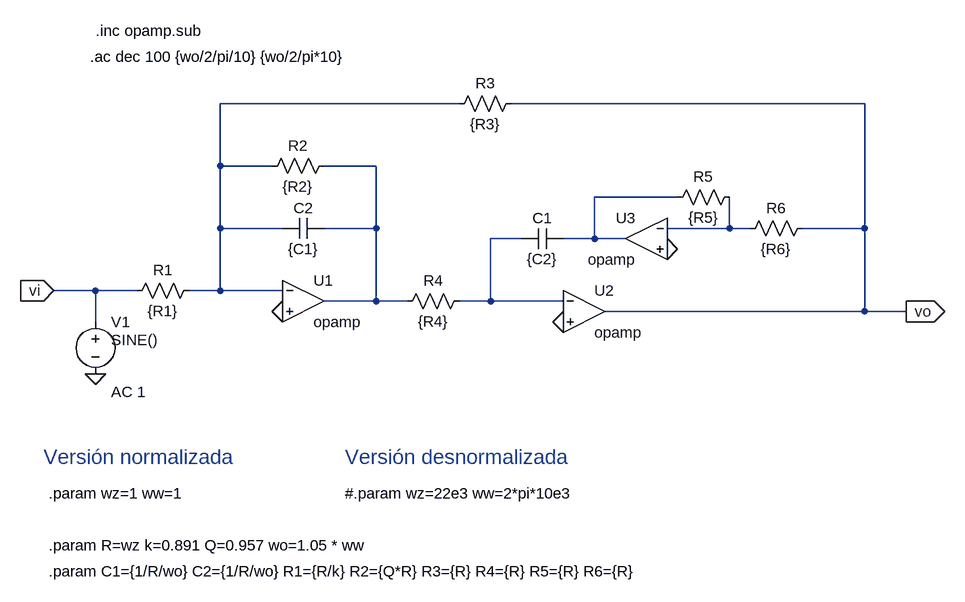
[diagram p0: schematic ACKMOSS cheby clase 7.asc]
ACKMOSS cheby clase 7.asc, the LTspice schematic file:
Version 4
SHEET 1 2172 888
WIRE 384 -48 16 -48
WIRE 1008 -48 464 -48
WIRE 16 48 16 -48
WIRE 96 48 16 48
WIRE 256 48 176 48
WIRE 720 96 592 96
WIRE 16 144 16 48
WIRE 112 144 16 144
WIRE 256 144 256 48
WIRE 256 144 176 144
WIRE 800 144 800 96
WIRE 800 144 704 144
WIRE 832 144 800 144
WIRE 1008 144 1008 -48
WIRE 1008 144 912 144
WIRE 480 160 432 160
WIRE 592 160 592 96
WIRE 592 160 544 160
WIRE 640 160 592 160
WIRE -176 240 -240 240
WIRE -112 240 -176 240
WIRE 16 240 16 144
WIRE 16 240 -32 240
WIRE 112 240 16 240
WIRE 256 256 256 144
WIRE 256 256 176 256
WIRE 304 256 256 256
WIRE 432 256 432 160
WIRE 432 256 384 256
WIRE 544 256 432 256
WIRE 1008 272 1008 144
WIRE 1008 272 608 272
WIRE 1072 272 1008 272
WIRE -176 288 -176 240
FLAG 544 288 0
FLAG 112 272 0
FLAG 704 176 0
FLAG 1072 272 vo
IOPIN 1072 272 Out
FLAG -176 368 0
FLAG -240 240 vi
IOPIN -240 240 In
SYMBOL res -16 224 R90
WINDOW 0 0 56 VBottom 2
WINDOW 3 32 56 VTop 2
SYMATTR InstName R1
SYMATTR Value {R1}
SYMBOL res 192 32 R90
WINDOW 0 0 56 VBottom 2
WINDOW 3 32 56 VTop 2
SYMATTR InstName R2
SYMATTR Value {R2}
SYMBOL res 480 -64 R90
WINDOW 0 0 56 VBottom 2
WINDOW 3 32 56 VTop 2
SYMATTR InstName R3
SYMATTR Value {R3}
SYMBOL res 400 240 R90
WINDOW 0 0 56 VBottom 2
WINDOW 3 32 56 VTop 2
SYMATTR InstName R4
SYMATTR Value {R4}
SYMBOL res 816 80 R90
WINDOW 0 0 56 VBottom 2
WINDOW 3 32 56 VTop 2
SYMATTR InstName R5
SYMATTR Value {R5}
SYMBOL res 928 128 R90
WINDOW 0 0 56 VBottom 2
WINDOW 3 32 56 VTop 2
SYMATTR InstName R6
SYMATTR Value {R6}
SYMBOL cap 544 144 R90
WINDOW 0 0 32 VBottom 2
WINDOW 3 32 32 VTop 2
SYMATTR InstName C1
SYMATTR Value {C2}
SYMBOL cap 176 128 R90
WINDOW 0 0 32 VBottom 2
WINDOW 3 32 32 VTop 2
SYMATTR InstName C2
SYMATTR Value {C1}
SYMBOL OpAmps\\opamp 144 192 R0
SYMATTR InstName U1
SYMBOL OpAmps\\opamp 576 208 R0
SYMATTR InstName U2
SYMBOL OpAmps\\opamp 672 96 M0
SYMATTR InstName U3
SYMBOL voltage -176 272 R0
WINDOW 123 24 124 Left 2
WINDOW 39 0 0 Left 0
WINDOW 3 24 44 Left 2
SYMATTR Value2 AC 1
SYMATTR Value SINE()
SYMATTR InstName V1
TEXT -176 -160 Left 2 !.inc opamp.sub
TEXT -184 -120 Left 2 !.ac dec 100 {wo/2/pi/10} {wo/2/pi*10}
TEXT -248 632 Left 2 !.param R=wz k=0.891 Q=0.957 wo=1.05 * ww
TEXT 208 552 Left 2 !#.param wz=22e3 ww=2*pi*10e3
TEXT -256 496 Left 3 ;Versión normalizada
TEXT 208 496 Left 3 ;Versión desnormalizada
TEXT -248 672 Left 2 !.param C1={1/R/wo} C2={1/R/wo} R1={R/k} R2={Q*R} R3={R} R4={R} R5={R} R6={R}
TEXT -248 552 Left 2 !.param wz=1 ww=1

The netlist it stands for:
* ACKMOSS cheby clase 7.asc
R1 N001 vi {R1}
R2 N002 N001 {R2}
R3 vo N001 {R3}
R4 N005 N002 {R4}
R5 N004 N003 {R5}
R6 vo N004 {R6}
C1 N003 N005 {C2}
C2 N002 N001 {C1}
XU1 N001 0 N002 opamp Aol=100K GBW=10Meg  ; pins invin noninvin out
XU2 N005 0 vo opamp Aol=100K GBW=10Meg  ; pins invin noninvin out
XU3 N004 0 N003 opamp Aol=100K GBW=10Meg  ; pins invin noninvin out
V1 vi 0 SINE() AC 1
.inc opamp.sub
.ac dec 100 {wo/2/pi/10} {wo/2/pi*10}
.param R=wz k=0.891 Q=0.957 wo=1.05 * ww
#.param wz=22e3 ww=2*pi*10e3
* Versión normalizada
* Versión desnormalizada
.param C1={1/R/wo} C2={1/R/wo} R1={R/k} R2={Q*R} R3={R} R4={R} R5={R} R6={R}
.param wz=1 ww=1
.backanno
.end